# Altium schematic sheet H18R2_Backend.SchDoc
size Letter; CompanyName: Hexabitz; DocumentNumber: 2; SheetNumber: 1; SheetTotal: 2; Module_Name: H18R2; Module_Description: Brushed DC Motor Driver
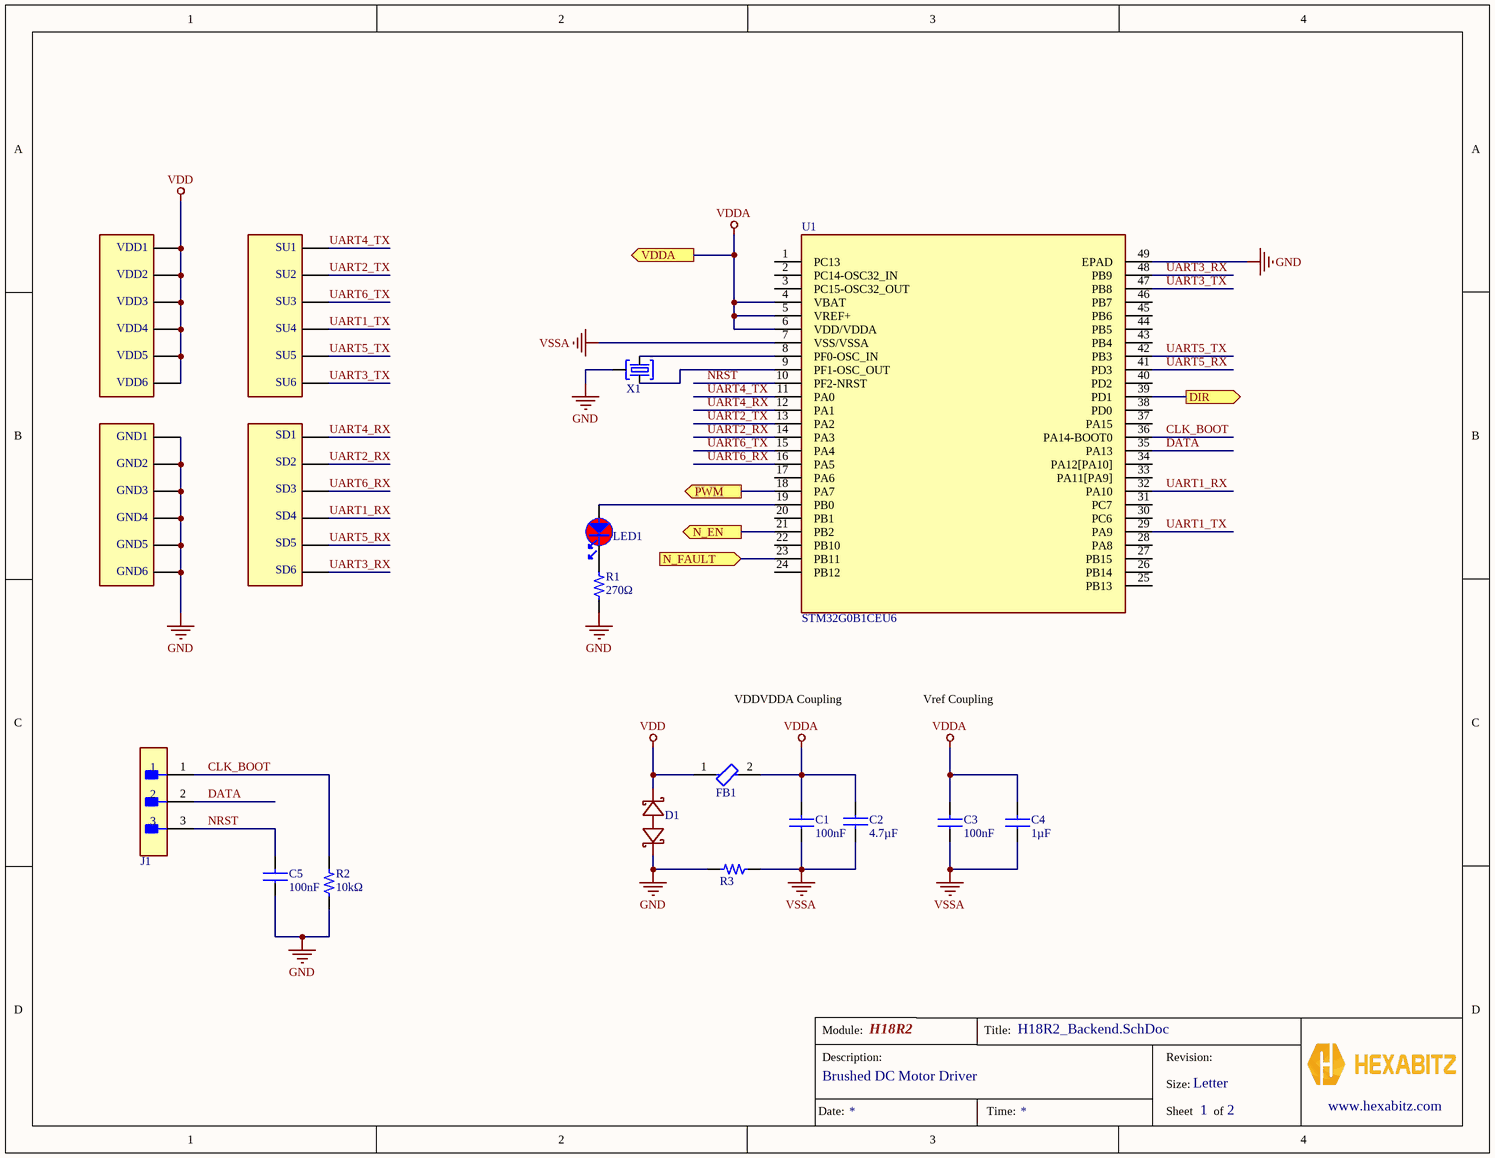
[diagram p0: H18R2_Backend.SchDoc]

## Parts
C1  value 100nF  [C0603]  (hidden comment: CL10B104KA8NNNC)
C2  value 4.7µF  [C0805]  (hidden comment: CL21X475KAQNNNE)
C3  value 100nF  [C0603]  (hidden comment: CL10B104KA8NNNC)
C4  value 1µF  [C0805]  (hidden comment: CC0805KKX7R7BB105)
C5  value 100nF  [C0603]  (hidden comment: CL10B104KA8NNNC)
D1  CDSOD323-T03SC  [SOD2513X114N]  (value not drawn)
FB1  MMZ1608Y300B  [FP-MMZ1608-0_8-MFG]  (value not drawn)
GND1  HEXABIT_UART_PORT  [HEXABIT_POWER_PORT_D]  (value not drawn)  (no BOM)
GND2  HEXABIT_UART_PORT  [HEXABIT_POWER_PORT_D]  (value not drawn)  (no BOM)
GND3  HEXABIT_UART_PORT  [HEXABIT_POWER_PORT_D]  (value not drawn)  (no BOM)
GND4  HEXABIT_UART_PORT  [HEXABIT_POWER_PORT_D]  (value not drawn)  (no BOM)
GND5  HEXABIT_UART_PORT  [HEXABIT_POWER_PORT_D]  (value not drawn)  (no BOM)
GND6  HEXABIT_UART_PORT  [HEXABIT_POWER_PORT_D]  (value not drawn)  (no BOM)
J1  TSW-103-14-G-S  [FP-TSW-103-14-G-S-MFG]  (value not drawn)
LED1  VLMS1300-GS08  [FP-6_541-5092_01-4-MFG]  (value not drawn)
R1  value 270Ω  [R0603]  (hidden comment: Manufacturer Part Number)
R2  value 10kΩ  [R0603]  (hidden comment: Manufacturer Part Number)
R3  Manufacturer Part Number  [R0603]  (value not drawn)
SD1  HEXABIT_UART_PORT  [HEXABIT_UART_PORT_D]  (value not drawn)  (no BOM)
SD2  HEXABIT_UART_PORT  [HEXABIT_UART_PORT_D]  (value not drawn)  (no BOM)
SD3  HEXABIT_UART_PORT  [HEXABIT_UART_PORT_D]  (value not drawn)  (no BOM)
SD4  HEXABIT_UART_PORT  [HEXABIT_UART_PORT_D]  (value not drawn)  (no BOM)
SD5  HEXABIT_UART_PORT  [HEXABIT_UART_PORT_D]  (value not drawn)  (no BOM)
SD6  HEXABIT_UART_PORT  [HEXABIT_UART_PORT_D]  (value not drawn)  (no BOM)
SU1  HEXABIT_UART_PORT  [HEXABIT_UART_PORT_U]  (value not drawn)  (no BOM)
SU2  HEXABIT_UART_PORT  [HEXABIT_UART_PORT_U]  (value not drawn)  (no BOM)
SU3  HEXABIT_UART_PORT  [HEXABIT_UART_PORT_U]  (value not drawn)  (no BOM)
SU4  HEXABIT_UART_PORT  [HEXABIT_UART_PORT_U]  (value not drawn)  (no BOM)
SU5  HEXABIT_UART_PORT  [HEXABIT_UART_PORT_U]  (value not drawn)  (no BOM)
SU6  HEXABIT_UART_PORT  [HEXABIT_UART_PORT_U]  (value not drawn)  (no BOM)
U1  STM32G0B1CEU6  [QFN50P700X700X65-49N-D]
VDD1  HEXABIT_UART_PORT  [HEXABIT_POWER_PORT_U]  (value not drawn)  (no BOM)
VDD2  HEXABIT_UART_PORT  [HEXABIT_POWER_PORT_U]  (value not drawn)  (no BOM)
VDD3  HEXABIT_UART_PORT  [HEXABIT_POWER_PORT_U]  (value not drawn)  (no BOM)
VDD4  HEXABIT_UART_PORT  [HEXABIT_POWER_PORT_U]  (value not drawn)  (no BOM)
VDD5  HEXABIT_UART_PORT  [HEXABIT_POWER_PORT_U]  (value not drawn)  (no BOM)
VDD6  HEXABIT_UART_PORT  [HEXABIT_POWER_PORT_U]  (value not drawn)  (no BOM)
X1  CSTCE8M00G52Z-R0  [XTALL_CSTCE8M00G52]  (value not drawn)

## Ports
DIR (out), N_EN (out), N_FAULT (in), PWM (out), VDDA (out)

## Nets
GND: C5.1 D1.1(A) GND1.Pwr_D GND2.Pwr_D GND3.Pwr_D GND4.Pwr_D GND5.Pwr_D GND6.Pwr_D R1.1 R2.2 R3.1 U1.49(EPAD) X1.P$2
VDD: D1.2(C) FB1.1 VDD1.Pwr_U VDD2.Pwr_U VDD3.Pwr_U VDD4.Pwr_U VDD5.Pwr_U VDD6.Pwr_U
VDDA: C1.2 C2.1 C3.2 C4.2 FB1.2 U1.4(VBAT) U1.5(VREF+) U1.6(VDD/VDDA) ; port VDDA
VSSA: C1.1 C2.2 C3.1 C4.1 R3.2 U1.7(VSS/VSSA)
CLK_BOOT: J1.1 R2.1 U1.36(PA14-BOOT0)
DATA: J1.2 U1.35(PA13)
DIR: U1.39(PD1) ; port DIR
N_EN: U1.21(PB2) ; port N_EN
N_FAULT: U1.23(PB11) ; port N_FAULT
NRST: C5.2 J1.3 U1.10(PF2-NRST)
PWM: U1.18(PA7) ; port PWM
UART1_RX: SD4.UART_D U1.32(PA10)
UART1_TX: SU4.UART_U U1.29(PA9)
UART2_RX: SD2.UART_D U1.14(PA3)
UART2_TX: SU2.UART_U U1.13(PA2)
UART3_RX: SD6.UART_D U1.48(PB9)
UART3_TX: SU6.UART_U U1.47(PB8)
UART4_RX: SD1.UART_D U1.12(PA1)
UART4_TX: SU1.UART_U U1.11(PA0)
UART5_RX: SD5.UART_D U1.41(PD3)
UART5_TX: SU5.UART_U U1.42(PB3)
UART6_RX: SD3.UART_D U1.16(PA5)
UART6_TX: SU3.UART_U U1.15(PA4)
NetLED1_1: LED1.1 R1.2
NetLED1_2: LED1.2 U1.19(PB0)
NetU1_8: U1.8(PF0-OSC_IN) X1.P$3
NetU1_9: U1.9(PF1-OSC_OUT) X1.P$1

Not connected (* = marked no-connect by the designer): U1 1(PC13) 2(PC14-OSC32_IN) 3(PC15-OSC32_OUT) 17(PA6) 20(PB1) 22(PB10) 24(PB12) 25(PB13) 26(PB14) 27(PB15) 28(PA8) 30(PC6) 31(PC7) 33(PA11[PA9]) 34(PA12[PA10]) 37(PA15) 38(PD0) 40(PD2) 43(PB4) 44(PB5) 45(PB6) 46(PB7)

## Notes on the sheet
- VDDVDDA Coupling
- Vref Coupling
- Module:
- Title:
- Description:
- Size:
- Revision:
- Letter
- www.hexabitz.com
- Date:
- Time:
- Sheet
- of

## Library data of the parts
C1 C3 C5 = generic Capacitor: Ceramic Capacitor, Multilayer, Ceramic, 25V, 10% +Tol, 10% -Tol, X7R, +-15% TC, 100nF, Surface Mount, 0603 inch; Manufacturer: Samsung Electro-Mechanics; Library: Hexabitz; Supplier: Avnet; Supplier Part Number: CL10B104KA8NNNC; Manufacturer Part Number: CL10B104KA8NNNC; RoHS: Compliant; Category: Ceramic Capacitors; Stock: 1332000; Pricing: 4000=0.00265, 8000=0.00263, 16000=0.00262, 24000=0.00261, 32000=0.00259 (USD); Case/Package: 0603; Case Code (Imperial): 0603; Case Code (Metric): 1608; China RoHS: Compliant; Depth: 800µm; Dielectric: X7R; Dielectric Material: Ceramic; Height: 800µm; Lead Free: Lead Free; Length: 1.6mm; Lifecycle Status: Production; Material: Ceramic; Max Operating Temperature: 125°C; Min Operating Temperature: -55°C; Mounting Technology: Surface Mount; Number of Terminals: 2; Radiation Hardening: No; REACH SVHC: Yes; Schedule B: 8532240020, 8532240020|8532240020, 8532240020|8532240020|8532240020, 8532240020|8532240020|8532240020|8532240020; Thickness: 889µm; Tolerance: 10%; Voltage: 25V; Voltage Rating: 25V; Voltage Rating (DC): 25V; Width: 800µm; ComponentLink1URL: https://datasheet.octopart.com:443/CL10B104KA8NNNC-Samsung-Electro-Mechanics-datasheet-137745067.pdf?src-supplier=Newark; ComponentLink1Description: https://datasheet.octopart.com:443/CL10B104KA8NNNC-Samsung-Electro-Mechanics-datasheet-137745067.pdf?src-supplier=Newark; ComponentLink2URL: https://datasheet.octopart.com:443/CL10B104KA8NNNC-Samsung-Electro-Mechanics-datasheet-181551448.pdf?src-supplier=Newark; ComponentLink2Description: https://datasheet.octopart.com:443/CL10B104KA8NNNC-Samsung-Electro-Mechanics-datasheet-181551448.pdf?src-supplier=Newark; ComponentLink3URL: https://datasheet.octopart.com/CL10B104KA8NNNC-Samsung-Electro-Mechanics-datasheet-8324245.pdf; ComponentLink3Description: https://datasheet.octopart.com/CL10B104KA8NNNC-Samsung-Electro-Mechanics-datasheet-8324245.pdf; ComponentLink4URL: https://datasheet.octopart.com/CL10B104KA8NNNC-Samsung-Electro-Mechanics-datasheet-97040617.pdf; ComponentLink4Description: https://datasheet.octopart.com/CL10B104KA8NNNC-Samsung-Electro-Mechanics-datasheet-97040617.pdf; ComponentLink5URL: https://datasheet.octopart.com/General-Multilayer-Ceramic-Capacitors-Samsung-datasheet-family-111.pdf; ComponentLink5Description: https://datasheet.octopart.com/General-Multilayer-Ceramic-Capacitors-Samsung-datasheet-family-111.pdf; ComponentLink6URL: https://datasheet.octopart.com:443/CL10B104KA8NNNC-Samsung-Electro-Mechanics-datasheet-116890967.pdf?src-supplier=Future+Electronics; ComponentLink6Description: https://datasheet.octopart.com:443/CL10B104KA8NNNC-Samsung-Electro-Mechanics-datasheet-116890967.pdf?src-supplier=Future+Electronics; ComponentLink7URL: https://datasheet.octopart.com:443/CL10B104KA8NNNC-Samsung-Electro-Mechanics-datasheet-81461838.pdf?src-supplier=Future+Electronics; ComponentLink7Description: https://datasheet.octopart.com:443/CL10B104KA8NNNC-Samsung-Electro-Mechanics-datasheet-81461838.pdf?src-supplier=Future+Electronics; ComponentLink8URL: https://datasheet.octopart.com:443/CL10B104KA8NNNC-Samsung-datasheet-42770371.pdf?src-supplier=Future+Electronics; ComponentLink8Description: https://datasheet.octopart.com:443/CL10B104KA8NNNC-Samsung-datasheet-42770371.pdf?src-supplier=Future+Electronics; ComponentLink9URL: https://datasheet.octopart.com:443/CL10B104KA8NNNC-Samsung-datasheet-26589152.pdf?src-supplier=Future+Electronics; ComponentLink9Description: https://datasheet.octopart.com:443/CL10B104KA8NNNC-Samsung-datasheet-26589152.pdf?src-supplier=Future+Electronics; ComponentLink10URL: https://datasheet.octopart.com:443/CL10B104KA8NNNC-Samsung-Electro-Mechanics-datasheet-149136783.pdf?src-supplier=Future+Electronics; ComponentLink10Description: https://datasheet.octopart.com:443/CL10B104KA8NNNC-Samsung-Electro-Mechanics-datasheet-149136783.pdf?src-supplier=Future+Electronics; ComponentLink11URL: https://datasheet.octopart.com:443/CL10B104KA8NNNC-Samsung-datasheet-59220082.pdf?src-supplier=TME; ComponentLink11Description: https://datasheet.octopart.com:443/CL10B104KA8NNNC-Samsung-datasheet-59220082.pdf?src-supplier=TME; ComponentLink12URL: https://datasheet.octopart.com:443/CL10B104KA8NNNC-Samsung-Electro-Mechanics-datasheet-11756025.pdf?src-supplier=Arrow+Electronics; ComponentLink12Description: https://datasheet.octopart.com:443/CL10B104KA8NNNC-Samsung-Electro-Mechanics-datasheet-11756025.pdf?src-supplier=Arrow+Electronics; ComponentLink13URL: http://sigma.octopart.com:80/rohs_certificate/General-Multilayer-Ceramic-Capacitors-Samsung-family-110.pdf?src-supplier=Compliance+Statements; ComponentLink13Description: http://sigma.octopart.com:80/rohs_certificate/General-Multilayer-Ceramic-Capacitors-Samsung-family-110.pdf?src-supplier=Compliance+Statements; ComponentLink14URL: http://sigma.octopart.com:80/rohs_statement/General-Multilayer-Ceramic-Capacitors-Samsung-family-132.pdf?src-supplier=Compliance+Statements; ComponentLink14Description: http://sigma.octopart.com:80/rohs_statement/General-Multilayer-Ceramic-Capacitors-Samsung-family-132.pdf?src-supplier=Compliance+Statements; ComponentLink15URL: http://sigma.octopart.com:80/reach_statement/General-Multilayer-Ceramic-Capacitors-Samsung-family-133.pdf?src-supplier=Compliance+Statements; ComponentLink15Description: http://sigma.octopart.com:80/reach_statement/General-Multilayer-Ceramic-Capacitors-Samsung-family-133.pdf?src-supplier=Compliance+Statements
  C1: Octopart URL: https://octopart.com/part/samsung-electro-mechanics/CL10B104KA8NNNC
  C5: Supplier 1: Avnet; Supplier Part Number 1: CL10B104KA8NNNC; Octopart URL: https://octopart.com/part/samsung-electro-mechanics/CL10B104KA8NNNC
C2 = generic Capacitor: Ceramic Capacitor, Multilayer, Ceramic, 25V, 10% +Tol, 10% -Tol, X6S, +-22% TC, 4.7uF, Surface Mount, 0805 inch; Manufacturer: Samsung Electro-Mechanics; Library: Hexabitz; Supplier: DigiKey; Supplier Part Number: 1276-3033-1-ND; Manufacturer Part Number: CL21X475KAQNNNE; RoHS: Compliant; Category: Ceramic Capacitors; Stock: 251721; Pricing: 1=0.21, 10=0.124, 50=0.0886, 100=0.0778, 500=0.05972, 1000=0.05414 (USD); Case/Package: 0805; Case Code (Imperial): 0805; Case Code (Metric): 2012; China RoHS: Compliant; Depth: 1.25mm; Dielectric: X6S; Dielectric Material: Ceramic; Height: 1.4mm; Lead Free: Lead Free; Length: 2mm; Lifecycle Status: Production; Material: Ceramic; Max Operating Temperature: 105°C; Min Operating Temperature: -55°C; Mounting Technology: Surface Mount; Number of Terminals: 2; Packaging: Tape & Reel (TR); REACH SVHC: Yes; Schedule B: 8532240020, 8532240020|8532240020, 8532240020|8532240020|8532240020, 8532240020|8532240020|8532240020|8532240020; Thickness: 1.397mm; Tolerance: 10%; Voltage Rating: 25V; Voltage Rating (DC): 25V; Width: 1.25mm; ComponentLink1URL: https://datasheet.octopart.com:443/CL21X475KAQNNNE-Samsung-Electro-Mechanics-datasheet-141347921.pdf?src-supplier=IHS; ComponentLink1Description: https://datasheet.octopart.com:443/CL21X475KAQNNNE-Samsung-Electro-Mechanics-datasheet-141347921.pdf?src-supplier=IHS; ComponentLink2URL: https://datasheet.octopart.com/CL21X475KAQNNNE-Samsung-Electro-Mechanics-datasheet-97040617.pdf; ComponentLink2Description: https://datasheet.octopart.com/CL21X475KAQNNNE-Samsung-Electro-Mechanics-datasheet-97040617.pdf; ComponentLink3URL: https://datasheet.octopart.com/CL21X475KAQNNNE-Samsung-Electro-Mechanics-datasheet-8324245.pdf; ComponentLink3Description: https://datasheet.octopart.com/CL21X475KAQNNNE-Samsung-Electro-Mechanics-datasheet-8324245.pdf; ComponentLink4URL: https://datasheet.octopart.com:443/CL21X475KAQNNNE-Samsung-datasheet-8326817.pdf?src-supplier=Future+Electronics; ComponentLink4Description: https://datasheet.octopart.com:443/CL21X475KAQNNNE-Samsung-datasheet-8326817.pdf?src-supplier=Future+Electronics; ComponentLink5URL: https://datasheet.octopart.com:443/CL21X475KAQNNNE-Samsung-datasheet-8326407.pdf?src-supplier=TME; ComponentLink5Description: https://datasheet.octopart.com:443/CL21X475KAQNNNE-Samsung-datasheet-8326407.pdf?src-supplier=TME; ComponentLink6URL: https://datasheet.octopart.com:443/CL21X475KAQNNNE-Samsung-Electro-Mechanics-datasheet-11541288.pdf?src-supplier=Arrow+Electronics; ComponentLink6Description: https://datasheet.octopart.com:443/CL21X475KAQNNNE-Samsung-Electro-Mechanics-datasheet-11541288.pdf?src-supplier=Arrow+Electronics; Octopart URL: https://octopart.com/part/samsung-electro-mechanics/CL21A475KAQNNNE
C4 = generic Capacitor: Ceramic Capacitor, Ceramic, 16V, 10% +Tol, 10% -Tol, X7R, 15% TC, 1uF, Surface Mount, 0805; Manufacturer: Yageo Group; Manufacturer Package Identifier: CC0805-0.85; Library: Hexabitz; Supplier: Future Electronics; Supplier Part Number: 9937277; Manufacturer Part Number: CC0805KKX7R7BB105; RoHS: Compliant; Category: Ceramic Capacitors; Stock: 384000; Pricing: 3000=0.0057, 12000=0.0055, 45000=0.0053, 90000=0.0052, 225000=0.005 (USD); Case/Package: 0805; Case Code (Imperial): 0805; Case Code (Metric): 2012; China RoHS: Compliant; Depth: 1.25mm; Dielectric: X7R; Dielectric Material: Ceramic; Halogen Free: Halogen Free; Height: 1.25mm; Lead Free: Lead Free; Length: 2mm; Lifecycle Status: Production; Material: Ceramic; Max Operating Temperature: 125°C; Min Operating Temperature: -55°C; Mounting Technology: Surface Mount; Pins: 2; Number of Terminals: 2; Radiation Hardening: No; REACH SVHC: Yes; Schedule B: 8532240020, 8532240020|8532240020|8532240020|8532240020|8532240020|8532240020|8532240020|8532240020|8532240020|8532240020|8532240020|8532240020, 8532240020|8532240020|8532240020|8532240020|8532240020|8532240020|8532240020|8532240020|8532240020|8532240020|8532240020|8532240020|8532240020, 8532240020|8532240020|8532240020|8532240020|8532240020|8532240020|8532240020|8532240020|8532240020|8532240020|8532240020|8532240020|8532240020|8532240020; Termination: SMD/SMT; Thickness: 1.2446mm; Tolerance: 10%; Voltage Rating: 16V; Voltage Rating (DC): 16V; Width: 1.25mm; ComponentLink1URL: https://datasheet.octopart.com:443/CC0805KKX7R7BB105-Yageo-datasheet-177165144.pdf?src-supplier=IHS; ComponentLink1Description: https://datasheet.octopart.com:443/CC0805KKX7R7BB105-Yageo-datasheet-177165144.pdf?src-supplier=IHS; ComponentLink2URL: https://datasheet.octopart.com:443/CC0805KKX7R7BB105-Yageo-datasheet-78855689.pdf?src-supplier=Upverter; ComponentLink2Description: https://datasheet.octopart.com:443/CC0805KKX7R7BB105-Yageo-datasheet-78855689.pdf?src-supplier=Upverter; ComponentLink3URL: https://datasheet.octopart.com/CC0805KKX7R7BB105-Yageo-datasheet-10883670.pdf; ComponentLink3Description: https://datasheet.octopart.com/CC0805KKX7R7BB105-Yageo-datasheet-10883670.pdf; ComponentLink4URL: https://datasheet.octopart.com:443/CC0805KKX7R7BB105-Yageo-datasheet-140260305.pdf?src-supplier=SOS+electronic; ComponentLink4Description: https://datasheet.octopart.com:443/CC0805KKX7R7BB105-Yageo-datasheet-140260305.pdf?src-supplier=SOS+electronic; ComponentLink5URL: https://datasheet.octopart.com:443/CC0805KKX7R7BB105-Yageo-datasheet-147453679.pdf?src-supplier=Farnell; ComponentLink5Description: https://datasheet.octopart.com:443/CC0805KKX7R7BB105-Yageo-datasheet-147453679.pdf?src-supplier=Farnell; ComponentLink6URL: https://datasheet.octopart.com:443/CC0805KKX7R7BB105-Yageo-datasheet-181969634.pdf?src-supplier=Farnell; ComponentLink6Description: https://datasheet.octopart.com:443/CC0805KKX7R7BB105-Yageo-datasheet-181969634.pdf?src-supplier=Farnell; ComponentLink7URL: https://datasheet.octopart.com:443/CC0805KKX7R7BB105-Yageo-datasheet-62336348.pdf?src-supplier=element14+APAC; ComponentLink7Description: https://datasheet.octopart.com:443/CC0805KKX7R7BB105-Yageo-datasheet-62336348.pdf?src-supplier=element14+APAC; ComponentLink8URL: https://datasheet.octopart.com:443/CC0805KKX7R7BB105-Yageo-datasheet-166511530.pdf?src-supplier=Future+Electronics; ComponentLink8Description: https://datasheet.octopart.com:443/CC0805KKX7R7BB105-Yageo-datasheet-166511530.pdf?src-supplier=Future+Electronics; ComponentLink9URL: https://datasheet.octopart.com:443/CC0805KKX7R7BB105-Yageo-datasheet-137700082.pdf?src-supplier=Future+Electronics; ComponentLink9Description: https://datasheet.octopart.com:443/CC0805KKX7R7BB105-Yageo-datasheet-137700082.pdf?src-supplier=Future+Electronics; ComponentLink10URL: https://datasheet.octopart.com:443/CC0805KKX7R7BB105-Yageo-datasheet-137700084.pdf?src-supplier=Future+Electronics; ComponentLink10Description: https://datasheet.octopart.com:443/CC0805KKX7R7BB105-Yageo-datasheet-137700084.pdf?src-supplier=Future+Electronics; ComponentLink11URL: https://datasheet.octopart.com:443/CC0805KKX7R7BB105-Yageo-datasheet-27626582.pdf?src-supplier=Future+Electronics; ComponentLink11Description: https://datasheet.octopart.com:443/CC0805KKX7R7BB105-Yageo-datasheet-27626582.pdf?src-supplier=Future+Electronics; ComponentLink12URL: https://datasheet.octopart.com:443/CC0805KKX7R7BB105-Yageo-datasheet-15895757.pdf?src-supplier=Future+Electronics; ComponentLink12Description: https://datasheet.octopart.com:443/CC0805KKX7R7BB105-Yageo-datasheet-15895757.pdf?src-supplier=Future+Electronics; ComponentLink13URL: https://datasheet.octopart.com:443/CC0805KKX7R7BB105-Yageo-datasheet-12526321.pdf?src-supplier=Future+Electronics; ComponentLink13Description: https://datasheet.octopart.com:443/CC0805KKX7R7BB105-Yageo-datasheet-12526321.pdf?src-supplier=Future+Electronics; ComponentLink14URL: https://datasheet.octopart.com:443/CC0805KKX7R7BB105-Yageo-datasheet-10911834.pdf?src-supplier=Future+Electronics; ComponentLink14Description: https://datasheet.octopart.com:443/CC0805KKX7R7BB105-Yageo-datasheet-10911834.pdf?src-supplier=Future+Electronics; ComponentLink15URL: https://datasheet.octopart.com:443/CC0805KKX7R7BB105-Yageo-datasheet-8324442.pdf?src-supplier=Future+Electronics; ComponentLink15Description: https://datasheet.octopart.com:443/CC0805KKX7R7BB105-Yageo-datasheet-8324442.pdf?src-supplier=Future+Electronics; ComponentLink16URL: https://datasheet.octopart.com:443/CC0805KKX7R7BB105-Yageo-Group-datasheet-165992755.pdf?src-supplier=ODG+(Origin+Data+Global); ComponentLink16Description: https://datasheet.octopart.com:443/CC0805KKX7R7BB105-Yageo-Group-datasheet-165992755.pdf?src-supplier=ODG+(Origin+Data+Global); ComponentLink17URL: https://datasheet.octopart.com:443/CC0805KKX7R7BB105-Yageo-datasheet-151948686.pdf?src-supplier=TME; ComponentLink17Description: https://datasheet.octopart.com:443/CC0805KKX7R7BB105-Yageo-datasheet-151948686.pdf?src-supplier=TME; ComponentLink18URL: https://datasheet.octopart.com:443/CC0805KKX7R7BB105-Yageo-datasheet-8324192.pdf?src-supplier=TME; ComponentLink18Description: https://datasheet.octopart.com:443/CC0805KKX7R7BB105-Yageo-datasheet-8324192.pdf?src-supplier=TME; ComponentLink19URL: https://datasheet.octopart.com:443/CC0805KKX7R7BB105-Yageo-datasheet-120101875.pdf?src-supplier=Megastar; ComponentLink19Description: https://datasheet.octopart.com:443/CC0805KKX7R7BB105-Yageo-datasheet-120101875.pdf?src-supplier=Megastar; ComponentLink20URL: https://datasheet.octopart.com:443/CC0805KKX7R7BB105-Yageo-datasheet-8701427.pdf?src-supplier=element14; ComponentLink20Description: https://datasheet.octopart.com:443/CC0805KKX7R7BB105-Yageo-datasheet-8701427.pdf?src-supplier=element14; ComponentLink21URL: https://datasheet.octopart.com:443/CC0805KKX7R7BB105-Yageo-datasheet-499490.pdf?src-supplier=element14; ComponentLink21Description: https://datasheet.octopart.com:443/CC0805KKX7R7BB105-Yageo-datasheet-499490.pdf?src-supplier=element14; ComponentLink22URL: https://datasheet.octopart.com:443/CC0805KKX7R7BB105-Yageo-datasheet-5301394.pdf?src-supplier=element14; ComponentLink22Description: https://datasheet.octopart.com:443/CC0805KKX7R7BB105-Yageo-datasheet-5301394.pdf?src-supplier=element14; ComponentLink23URL: http://sigma.octopart.com:80/rohs_statement/Yageo-company-2.pdf?src-supplier=Compliance+Statements; ComponentLink23Description: http://sigma.octopart.com:80/rohs_statement/Yageo-company-2.pdf?src-supplier=Compliance+Statements; ComponentLink24URL: http://sigma.octopart.com:80/conflict_mineral_statement/Yageo-company-3.pdf?src-supplier=Compliance+Statements; ComponentLink24Description: http://sigma.octopart.com:80/conflict_mineral_statement/Yageo-company-3.pdf?src-supplier=Compliance+Statements; Supplier 1: Avnet; Supplier Part Number 1: 68R4880; Octopart URL: https://octopart.com/part/yageo-group/CC0805KKX7R7BB105
D1 = CDSOD323-T03SC: A 3V, 350W, bi-directional, standard capacitance, SOD323 pkg TVS Diode | Bourns CDSOD323-T03SC; Library: Hexabitz; Breakdown Voltage: 4V; Value: 200pF; Clamping Voltage: 10.9V; Direction: Bidirectional; Element Configuration: Single; Leakage Current: 125µA; Max Power Dissipation: 400W; Max Surge Current: 43A; Number of Bidirectional Channels: 1; Operating Supply Voltage: 3.3V; Power Line Protection: No; Supplier: DigiKey; Supplier Part Number: CDSOD323-T03SCDKR-ND; Manufacturer: Bourns; Manufacturer Part Number: CDSOD323-T03SC; RoHS: Compliant; Category: TVS Diodes; Stock: 937; Pricing: 1=0.69, 10=0.604, 100=0.418, 500=0.343, 1000=0.297 (USD); China RoHS: Compliant; Composition: Zener; Contact Plating: Tin; Depth: 1.45mm; Length: 1.9mm; Lifecycle Status: Production; Max Operating Temperature: 150°C; Min Breakdown Voltage: 4V; Min Operating Temperature: -55°C; Mounting Technology: Surface Mount; Number of Channels: 1; Number of Elements: 1; Pins: 2; Number of Terminals: 2; Peak Pulse Current: 43A; Peak Pulse Power: 400W; Peak Reverse Current: 125µA; Polarity: Bidirectional; Radiation Hardening: No; REACH SVHC: Yes; Reverse Standoff Voltage: 3.3V; Termination: SMD/SMT; Working Voltage: 3.3V; ComponentLink1URL: https://datasheet.octopart.com:443/CDSOD323-T03SC-Bourns-datasheet-179966067.pdf?src-supplier=IHS; ComponentLink1Description: https://datasheet.octopart.com:443/CDSOD323-T03SC-Bourns-datasheet-179966067.pdf?src-supplier=IHS; ComponentLink2URL: https://datasheet.octopart.com:443/CDSOD323-T03SC-Bourns-datasheet-134530207.pdf?src-supplier=Electro+Sonic; ComponentLink2Description: https://datasheet.octopart.com:443/CDSOD323-T03SC-Bourns-datasheet-134530207.pdf?src-supplier=Electro+Sonic; ComponentLink3URL: https://datasheet.octopart.com:443/CDSOD323-T03SC-Bourns-datasheet-11734656.pdf?src-supplier=Burklin+Elektronik; ComponentLink3Description: https://datasheet.octopart.com:443/CDSOD323-T03SC-Bourns-datasheet-11734656.pdf?src-supplier=Burklin+Elektronik; ComponentLink4URL: https://datasheet.octopart.com:443/CDSOD323-T03SC-Bourns-datasheet-37162147.pdf?src-supplier=Farnell; ComponentLink4Description: https://datasheet.octopart.com:443/CDSOD323-T03SC-Bourns-datasheet-37162147.pdf?src-supplier=Farnell; ComponentLink5URL: https://datasheet.octopart.com:443/CDSOD323-T03SC-Bourns-datasheet-159777421.pdf?src-supplier=RS+(Formerly+Allied+Electronics); ComponentLink5Description: https://datasheet.octopart.com:443/CDSOD323-T03SC-Bourns-datasheet-159777421.pdf?src-supplier=RS+(Formerly+Allied+Electronics); ComponentLink6URL: http://sigma.octopart.com:80/conflict_mineral_statement/Bourns-company-36.pdf?src-supplier=Compliance+Statements; ComponentLink6Description: http://sigma.octopart.com:80/conflict_mineral_statement/Bourns-company-36.pdf?src-supplier=Compliance+Statements; Supplier 1: DigiKey; Supplier Part Number 1: CDSOD323-T03SCDKR-ND; Octopart URL: https://octopart.com/part/bourns/CDSOD323-T03SC
FB1 = MMZ1608Y300B: Ferrite Beads 0603 30ohms 1500mA Signal Line AEC-Q200; Manufacturer: TDK; Manufacturer Part Number: MMZ1608Y300BTD25; Manufacturer Lifecycle Status: PRODUCTION; Library: Hexabitz; Current Rating: 1.5A; DC Resistance (DCR): 50mΩ; Impedance: 30Ω; Number of Circuits: 1; Test Frequency: 100MHz; Tolerance: 25%; Supplier: DigiKey; Supplier Part Number: 445-MMZ1608Y300BTD25DKR-ND; RoHS: Compliant; Category: Ferrite Beads and Chips; Stock: 11896; Pricing: 1=0.1, 10=0.06, 25=0.052, 50=0.0468, 100=0.0419, 250=0.03612, 500=0.03214, 1000=0.02847 (USD); Case/Package: 0603; Case Code (Imperial): 0603; Case Code (Metric): 1608; Core Material: Ferrite; Height: 800µm; Length: 1.6mm; Lifecycle Status: Production; Max Current Rating: 1.5A; Max DC Current: 1.5A; Max Length: 1.75mm; Max Operating Temperature: 125°C; Max Width: 950µm; Min Length: 1.45mm; Min Operating Temperature: -55°C; Min Width: 650µm; Mounting Technology: Surface Mount; Number of Lines: 1; Number of Terminals: 2; Packaging: Tape & Reel (TR); Ratings: AEC-Q200; REACH SVHC: Yes; RMS Current (Irms): 1.5A; ESR: 50mΩ; Termination: SMD/SMT; Weight: 2.012816mg; Width: 800µm; ComponentLink1URL: https://datasheet.octopart.com:443/MMZ1608Y300BTD25-TDK-datasheet-181268448.pdf?src-supplier=IHS; ComponentLink1Description: https://datasheet.octopart.com:443/MMZ1608Y300BTD25-TDK-datasheet-181268448.pdf?src-supplier=IHS; ComponentLink2URL: https://datasheet.octopart.com:443/MMZ1608Y300BTD25-TDK-datasheet-151367874.pdf?src-supplier=TDK; ComponentLink2Description: https://datasheet.octopart.com:443/MMZ1608Y300BTD25-TDK-datasheet-151367874.pdf?src-supplier=TDK; Supplier 1: Digikey; Supplier Part Number 1: 445-MMZ1608Y300BTA00DKR-ND; Octopart URL: https://octopart.com/part/tdk/MMZ1608Y300BTA00
GND1-GND6 = HEXABIT_POWER_PORT_D
J1 = CMP-02766-001743-1: CONN HEADER VERT 3POS 2.54MM; Manufacturer: Samtec; Max Voltage Rating (AC): 550V; Number of Positions: 3; Max Current Rating: 7.6A; Gender: Male; Termination: Solder; RoHS Compliant: Yes; Mount: Through Hole; Lead Free: Lead Free; Connector Type: Header; REACH SVHC: No SVHC; Insulation Color: Black; Width: 2.54mm; Length: 7.62mm; Flammability Rating: UL94 V-0; Housing Material: Polyester; Contact Material: Bronze; Max Operating Temperature: 125°C; Fastening Type: Pull; Series: TSW; Number of Contacts: 3; Packaging: Bulk; Min Operating Temperature: -55°C; Package Quantity: 1; Height: 10.67mm; Pitch: 2.54mm; Contact Finish - Mating: GOLD; Contact Type: Male Pin; Radiation Hardening: No; Color: Black; Housing Color: Black; Contact Plating: Gold; Orientation: Straight; Number of Rows: 1; Depth: 2.54mm; Insulation Material: PBT; Contact Mating Length: 0.32inch; Contact Shape: Square; Manufacturer Part Number: TSW-103-14-G-S; Octopart URL: https://octopart.com/part/samtec/TSW-103-14-G-S
LED1 = VLMS1300-GS08: LED Uni-Color Super Red 639nm 2-Pin Chip 0603(1608Metric) T/R; Manufacturer: Vishay Semiconductors; Library: Hexabitz; Viewing Angle: 130°; Lens Style: Rectangular,Clear; Number of LEDs: 1; Luminous Intensity: 54mcd; Forward Voltage: 2V; Wavelength: 631nm; Forward Current: 20mA; Power Rating: 75mW; Supplier: Digikey; Supplier Part Number: VLMS1300-GS08DKR-ND; Manufacturer Part Number: VLMS1300-GS08; RoHS: Yes; Category: LEDs; Stock: 56745; Pricing: 1=0.21, 10=0.143, 100=0.0998, 500=0.07982, 1000=0.07322 (USD); Mounting Technology: Surface Mount; Case/Package: 0603; Color: Red; Case Code (Metric): 1608; Case Code (Imperial): 0603; Min Operating Temperature: -35°C; Max Operating Temperature: 85°C; Package Quantity: 1; Packaging: Tape and Reel; Illumination Color: Red; Dominant Wavelength: 631nm; Test Current: 20mA; Series: CHipLED; Length: 1.6mm; Width: 0.8mm; Height: 0.8mm; Radiation Hardening: No; Lead Free: Lead Free; RoHS Compliant: Yes; Reach SVHC Compliant: Unknown; ComponentLink1URL: https://datasheet.ciiva.com/26322/vlmo1300-26322153.pdf?src-supplier=Element14; ComponentLink1Description: https://datasheet.ciiva.com/26322/vlmo1300-26322153.pdf?src-supplier=Element14; ComponentLink2URL: https://datasheet.ciiva.com/8028/vlmo1300-8028047.pdf?src-supplier=Element14; ComponentLink2Description: https://datasheet.ciiva.com/8028/vlmo1300-8028047.pdf?src-supplier=Element14; ComponentLink3URL: https://datasheet.ciiva.com/9333/vlmo1300-9333743.pdf?src-supplier=Avnet; ComponentLink3Description: https://datasheet.ciiva.com/9333/vlmo1300-9333743.pdf?src-supplier=Avnet; ComponentLink4URL: https://datasheet.ciiva.com/16510/vlmo1300-16510985.pdf?src-supplier=Future+Electronics; ComponentLink4Description: https://datasheet.ciiva.com/16510/vlmo1300-16510985.pdf?src-supplier=Future+Electronics; ComponentLink5URL: https://datasheet.ciiva.com/2114/vlmo1300-2114930.pdf?src-supplier=Digikey; ComponentLink5Description: https://datasheet.ciiva.com/2114/vlmo1300-2114930.pdf?src-supplier=Digikey; ComponentLink6URL: https://datasheet.ciiva.com/2114/vlmo1300-2114931.pdf?src-supplier=Digikey; ComponentLink6Description: https://datasheet.ciiva.com/2114/vlmo1300-2114931.pdf?src-supplier=Digikey; ComponentLink7URL: https://datasheet.ciiva.com/2114/vlmo1300-2114929.pdf?src-supplier=Digikey; ComponentLink7Description: https://datasheet.ciiva.com/2114/vlmo1300-2114929.pdf?src-supplier=Digikey; Supplier 1: Digikey; Supplier Part Number 1: VLMS1300-GS08DKR-ND; Octopart URL: https://octopart.com/part/vishay/VLMS1300-GS08
R1 = generic Resistor: Res Thick Film 0603 270 Ohm 5% 0.1W(1/10W) ±200ppm/C Pad SMD Automotive T/R; Manufacturer: Panasonic; Manufacturer Part Number: ERJ-3GEYJ271V; Library: Hexabitz; Max Power Dissipation: 100mW; Temperature Coefficient: 200ppm/°C; Voltage Rating: 75V; Supplier: Avnet; Supplier Part Number: ERJ-3GEYJ271V; RoHS: Compliant; Category: Chip SMD Resistors; Stock: 45000; Pricing: 5000=0.00355, 10000=0.00348, 20000=0.00342, 30000=0.00335, 40000=0.00329 (USD); Case/Package: 0603; Case Code (Imperial): 0603; Composition: Thick Film; Contact Plating: Tin; Depth: 800µm; Features: Automotive AEC-Q200; Height: 450µm; Lead Free: Lead Free; Length: 1.6mm; Lifecycle Status: Production; Max Operating Temperature: 155°C; Military Standard: Not; Min Operating Temperature: -55°C; Mounting Technology: Surface Mount; Number of Terminals: 2; Number of Terminations: 2; Packaging: Cut Tape; Power Dissipation: 100mW; Power Rating: 100mW; Radiation Hardening: No; REACH SVHC: Yes; Schedule B: 8533210045, 8533210045|8533210045|8533210045|8533210045|8533210045|8533210045|8533210045|8533210045|8533210045|8533210045|8533210045|8533210045|8533210045|8533210045|8533210045|8533210045|8533210045|8533210045|8533210045|8533210045|8533210045|8533210045|8533210045|85; Termination: SMD/SMT; Tolerance: 5%; Voltage Rating (DC): 75V; Width: 800µm; Working Voltage: 75V; ComponentLink1URL: https://datasheet.octopart.com:443/ERJ-3GEYJ271V-Panasonic-datasheet-13266872.pdf?src-supplier=RS+(Formerly+Allied+Electronics); ComponentLink1Description: https://datasheet.octopart.com:443/ERJ-3GEYJ271V-Panasonic-datasheet-13266872.pdf?src-supplier=RS+(Formerly+Allied+Electronics); ComponentLink2URL: https://datasheet.octopart.com:443/ERJ-3GEYJ271V-Panasonic-datasheet-5314550.pdf?src-supplier=Future+Electronics; ComponentLink2Description: https://datasheet.octopart.com:443/ERJ-3GEYJ271V-Panasonic-datasheet-5314550.pdf?src-supplier=Future+Electronics; ComponentLink3URL: https://datasheet.octopart.com:443/ERJ-3GEYJ271V-Panasonic-datasheet-61114972.pdf?src-supplier=Panasonic+SCT; ComponentLink3Description: https://datasheet.octopart.com:443/ERJ-3GEYJ271V-Panasonic-datasheet-61114972.pdf?src-supplier=Panasonic+SCT; ComponentLink4URL: https://datasheet.octopart.com:443/ERJ-3GEYJ271V-Panasonic-datasheet-147443676.pdf?src-supplier=Master+Electronics; ComponentLink4Description: https://datasheet.octopart.com:443/ERJ-3GEYJ271V-Panasonic-datasheet-147443676.pdf?src-supplier=Master+Electronics; ComponentLink5URL: https://datasheet.octopart.com:443/ERJ-3GEYJ271V-Panasonic-datasheet-10554283.pdf?src-supplier=element14+APAC; ComponentLink5Description: https://datasheet.octopart.com:443/ERJ-3GEYJ271V-Panasonic-datasheet-10554283.pdf?src-supplier=element14+APAC; ComponentLink6URL: https://datasheet.octopart.com:443/ERJ3GEYJ271V-Panasonic-datasheet-165581512.pdf?src-supplier=TME; ComponentLink6Description: https://datasheet.octopart.com:443/ERJ3GEYJ271V-Panasonic-datasheet-165581512.pdf?src-supplier=TME; ComponentLink7URL: https://datasheet.octopart.com:443/ERJ-3GEYJ271V-Panasonic-datasheet-164353788.pdf?src-supplier=Newark; ComponentLink7Description: https://datasheet.octopart.com:443/ERJ-3GEYJ271V-Panasonic-datasheet-164353788.pdf?src-supplier=Newark; ComponentLink8URL: https://datasheet.octopart.com:443/ERJ3GEYJ271V-Panasonic-datasheet-136608608.pdf?src-supplier=Farnell; ComponentLink8Description: https://datasheet.octopart.com:443/ERJ3GEYJ271V-Panasonic-datasheet-136608608.pdf?src-supplier=Farnell; ComponentLink9URL: https://datasheet.octopart.com:443/ERJ-3GEYJ271V-Panasonic---ECG-datasheet-15994758.pdf?src-supplier=Farnell; ComponentLink9Description: https://datasheet.octopart.com:443/ERJ-3GEYJ271V-Panasonic---ECG-datasheet-15994758.pdf?src-supplier=Farnell; ComponentLink10URL: https://datasheet.octopart.com:443/ERJ-3GEYJ271V-Panasonic-datasheet-5313456.pdf?src-supplier=Farnell; ComponentLink10Description: https://datasheet.octopart.com:443/ERJ-3GEYJ271V-Panasonic-datasheet-5313456.pdf?src-supplier=Farnell; ComponentLink11URL: https://datasheet.octopart.com/ERJ-3GEYJ271V-Panasonic-datasheet-78375410.pdf; ComponentLink11Description: https://datasheet.octopart.com/ERJ-3GEYJ271V-Panasonic-datasheet-78375410.pdf; ComponentLink12URL: https://datasheet.octopart.com/Thick-Film-Chip-Resistors-Panasonic-datasheet-family-105.pdf; ComponentLink12Description: https://datasheet.octopart.com/Thick-Film-Chip-Resistors-Panasonic-datasheet-family-105.pdf; ComponentLink13URL: https://datasheet.octopart.com:443/ERJ-3GEYJ271V-Panasonic-datasheet-7538305.pdf?src-supplier=Jameco; ComponentLink13Description: https://datasheet.octopart.com:443/ERJ-3GEYJ271V-Panasonic-datasheet-7538305.pdf?src-supplier=Jameco; ComponentLink14URL: https://datasheet.octopart.com:443/ERJ-3GEYJ271V-Panasonic-datasheet-118655.pdf?src-supplier=DigiKey; ComponentLink14Description: https://datasheet.octopart.com:443/ERJ-3GEYJ271V-Panasonic-datasheet-118655.pdf?src-supplier=DigiKey; ComponentLink15URL: https://datasheet.octopart.com:443/ERJ3GEYJ271V-Panasonic-datasheet-27908757.pdf?src-supplier=Electro+Sonic; ComponentLink15Description: https://datasheet.octopart.com:443/ERJ3GEYJ271V-Panasonic-datasheet-27908757.pdf?src-supplier=Electro+Sonic; ComponentLink16URL: https://datasheet.octopart.com:443/ERJ-3GEYJ271V-Panasonic-datasheet-37173568.pdf?src-supplier=Electro+Sonic; ComponentLink16Description: https://datasheet.octopart.com:443/ERJ-3GEYJ271V-Panasonic-datasheet-37173568.pdf?src-supplier=Electro+Sonic; Octopart URL: https://octopart.com/part/panasonic/ERJ-3GEYJ271V
R2 = generic Resistor: 100mW Thick Film Resistors ±100ppm/℃ ±1% 10kΩ 0603 Chip Resistor - Surface Mount ROHS; Manufacturer: Yageo Group; Manufacturer Part Number: RC0603FR-0710KL; Library: Hexabitz; Temperature Coefficient: 100ppm/°C; Voltage Rating: 75V; Voltage Rating (DC): 50V; Supplier: Future Electronics; Supplier Part Number: 4023214; RoHS: Compliant; Category: Chip SMD Resistors; Stock: 22990000; Pricing: 5000=0.001, 25000=0.001, 150000=0.001, 500000=0.0009, 1500000=0.0009 (USD); Case/Package: 0603; Case Code (Imperial): 0603; Case Code (Metric): 0603; China RoHS: Non-Compliant; Composition: Thick Film; Depth: 800µm; Height: 450µm; Lead Free: Lead Free; Lead Pitch: 300µm; Length: 1.6mm; Lifecycle Status: Production; Max Operating Temperature: 155°C; Military Standard: Not; Min Operating Temperature: -55°C; Mounting Technology: Surface Mount; Pins: 2; Number of Terminals: 2; Packaging: Tape & Reel; Power Dissipation: 100mW; Power Rating: 100mW; REACH SVHC: Yes; Schedule B: 8533210045, 8533210045|8533210045|8533210045|8533210045|8533210045|8533210045|8533210045|8533210045|8533210045|8533210045|8533210045|8533210045|8533210045|8533210045|8533210045|8533210045|8533210045|8533210045|8533210045|8533210045|8533210045|8533210045|8533210045|85; Termination: SMD/SMT; Tolerance: 1%; Weight: 2.012816mg; Width: 800µm; Working Voltage: 75V; ComponentLink1URL: https://datasheet.octopart.com:443/RC0603FR-0710KL-Yageo-datasheet-175887523.pdf?src-supplier=IHS; ComponentLink1Description: https://datasheet.octopart.com:443/RC0603FR-0710KL-Yageo-datasheet-175887523.pdf?src-supplier=IHS; ComponentLink2URL: https://datasheet.octopart.com:443/RC0603FR-0710KL-Yageo-datasheet-103092701.pdf?src-supplier=Upverter; ComponentLink2Description: https://datasheet.octopart.com:443/RC0603FR-0710KL-Yageo-datasheet-103092701.pdf?src-supplier=Upverter; ComponentLink3URL: https://datasheet.octopart.com:443/RC0603FR-0710KL-Yageo-datasheet-98239111.pdf?src-supplier=Upverter; ComponentLink3Description: https://datasheet.octopart.com:443/RC0603FR-0710KL-Yageo-datasheet-98239111.pdf?src-supplier=Upverter; ComponentLink4URL: https://datasheet.octopart.com:443/RC0603FR-0710KL-Yageo-datasheet-141265859.pdf?src-supplier=Upverter; ComponentLink4Description: https://datasheet.octopart.com:443/RC0603FR-0710KL-Yageo-datasheet-141265859.pdf?src-supplier=Upverter; ComponentLink5URL: https://sigma.octopart.com:443/138820526/technical_drawing/Yageo-RC0603FR-0710KL.pdf?src-supplier=Upverter; ComponentLink5Description: https://sigma.octopart.com:443/138820526/technical_drawing/Yageo-RC0603FR-0710KL.pdf?src-supplier=Upverter; ComponentLink6URL: https://datasheet.octopart.com:443/RC0603FR-0710KL-Yageo-datasheet-8328172.pdf?src-supplier=Farnell; ComponentLink6Description: https://datasheet.octopart.com:443/RC0603FR-0710KL-Yageo-datasheet-8328172.pdf?src-supplier=Farnell; ComponentLink7URL: https://datasheet.octopart.com:443/RC0603FR-0710KL-Yageo-datasheet-13691069.pdf?src-supplier=Farnell; ComponentLink7Description: https://datasheet.octopart.com:443/RC0603FR-0710KL-Yageo-datasheet-13691069.pdf?src-supplier=Farnell; ComponentLink8URL: https://datasheet.octopart.com:443/RC0603FR-0710KL-Yageo-datasheet-62067350.pdf?src-supplier=element14+APAC; ComponentLink8Description: https://datasheet.octopart.com:443/RC0603FR-0710KL-Yageo-datasheet-62067350.pdf?src-supplier=element14+APAC; ComponentLink9URL: https://datasheet.octopart.com:443/RC0603FR-0710KL-Yageo-datasheet-17842380.pdf?src-supplier=element14+APAC; ComponentLink9Description: https://datasheet.octopart.com:443/RC0603FR-0710KL-Yageo-datasheet-17842380.pdf?src-supplier=element14+APAC; ComponentLink10URL: https://datasheet.octopart.com:443/RC0603FR-0710KL-Yageo-datasheet-15599030.pdf?src-supplier=Future+Electronics; ComponentLink10Description: https://datasheet.octopart.com:443/RC0603FR-0710KL-Yageo-datasheet-15599030.pdf?src-supplier=Future+Electronics; ComponentLink11URL: https://datasheet.octopart.com:443/RC0603FR-0710KL-Yageo-datasheet-164759695.pdf?src-supplier=Future+Electronics; ComponentLink11Description: https://datasheet.octopart.com:443/RC0603FR-0710KL-Yageo-datasheet-164759695.pdf?src-supplier=Future+Electronics; ComponentLink12URL: https://datasheet.octopart.com:443/RC0603FR-0710KL-Yageo-datasheet-127823281.pdf?src-supplier=Future+Electronics; ComponentLink12Description: https://datasheet.octopart.com:443/RC0603FR-0710KL-Yageo-datasheet-127823281.pdf?src-supplier=Future+Electronics; ComponentLink13URL: https://datasheet.octopart.com:443/RC0603FR-0710KL-Yageo-datasheet-137700087.pdf?src-supplier=Future+Electronics; ComponentLink13Description: https://datasheet.octopart.com:443/RC0603FR-0710KL-Yageo-datasheet-137700087.pdf?src-supplier=Future+Electronics; ComponentLink14URL: https://datasheet.octopart.com:443/RC0603FR-0710KL-Yageo-datasheet-27584510.pdf?src-supplier=Future+Electronics; ComponentLink14Description: https://datasheet.octopart.com:443/RC0603FR-0710KL-Yageo-datasheet-27584510.pdf?src-supplier=Future+Electronics; ComponentLink15URL: https://datasheet.octopart.com:443/RC0603FR-0710KL-Yageo-datasheet-8324193.pdf?src-supplier=Future+Electronics; ComponentLink15Description: https://datasheet.octopart.com:443/RC0603FR-0710KL-Yageo-datasheet-8324193.pdf?src-supplier=Future+Electronics; ComponentLink16URL: https://datasheet.octopart.com:443/RC0603FR-0710KL-Yageo-datasheet-12596169.pdf?src-supplier=Newark; ComponentLink16Description: https://datasheet.octopart.com:443/RC0603FR-0710KL-Yageo-datasheet-12596169.pdf?src-supplier=Newark; ComponentLink17URL: https://datasheet.octopart.com:443/RC0603FR-0710KL-Yageo-datasheet-503470.pdf?src-supplier=Newark; ComponentLink17Description: https://datasheet.octopart.com:443/RC0603FR-0710KL-Yageo-datasheet-503470.pdf?src-supplier=Newark; ComponentLink18URL: https://datasheet.octopart.com:443/RC0603FR-0710KL-Yageo-datasheet-34211833.pdf?src-supplier=Newark; ComponentLink18Description: https://datasheet.octopart.com:443/RC0603FR-0710KL-Yageo-datasheet-34211833.pdf?src-supplier=Newark; ComponentLink19URL: https://datasheet.octopart.com:443/RC0603FR-0710KL-Yageo-datasheet-79472498.pdf?src-supplier=Megastar; ComponentLink19Description: https://datasheet.octopart.com:443/RC0603FR-0710KL-Yageo-datasheet-79472498.pdf?src-supplier=Megastar; ComponentLink20URL: https://datasheet.octopart.com/RC0603FR-0710KL-Yageo-datasheet-73766026.pdf; ComponentLink20Description: https://datasheet.octopart.com/RC0603FR-0710KL-Yageo-datasheet-73766026.pdf; ComponentLink21URL: https://datasheet.octopart.com:443/RC0603FR-0710KL-Yageo-datasheet-118562.pdf?src-supplier=DigiKey; ComponentLink21Description: https://datasheet.octopart.com:443/RC0603FR-0710KL-Yageo-datasheet-118562.pdf?src-supplier=DigiKey; ComponentLink22URL: http://sigma.octopart.com:80/rohs_statement/Yageo-company-2.pdf?src-supplier=Compliance+Statements; ComponentLink22Description: http://sigma.octopart.com:80/rohs_statement/Yageo-company-2.pdf?src-supplier=Compliance+Statements; ComponentLink23URL: http://sigma.octopart.com:80/conflict_mineral_statement/Yageo-company-3.pdf?src-supplier=Compliance+Statements; ComponentLink23Description: http://sigma.octopart.com:80/conflict_mineral_statement/Yageo-company-3.pdf?src-supplier=Compliance+Statements; Octopart URL: https://octopart.com/part/yageo-group/RC0603FR-0710KL
R3 = generic Resistor: Library: Hexabitz
SD1-SD6 = HEXABIT_UART_PORT_D
SU1-SU6 = HEXABIT_UART_PORT_U
U1 = STM32G0B1CEU6: MCU 32-bit ARM Cortex M0+ RISC 512KB Flash 1.8V/2.5V/3.3V 48-Pin UFQFPN EP Tray; Manufacturer: STMicroelectronics; Library: Hexabitz; Supplier: Digikey; Supplier Part Number: 497-STM32G0B1CEU6-ND; Manufacturer Part Number: STM32G0B1CEU6; RoHS: Yes; Category: Microcontrollers; Stock: 4305; Pricing: 1=4.78, 10=3.635, 25=3.3488, 100=3.0347, 260=2.87923, 520=2.7899, 1040=2.71638, 2600=2.63877 (USD); Supplier 1: Digikey; Supplier Part Number 1: 497-STM32G0B1CEU6-ND; Octopart URL: https://octopart.com/part/stmicroelectronics/STM32G0B1CEU6
VDD1-VDD6 = HEXABIT_POWER_PORT_U
X1 = CSTCE8M00G52Z-R0: Ceramic Resonator 8MHz ±0.5% (Tol) ±0.2% (Stability) 10pF 40Ohm 3-Pin CSMD T/R; Manufacturer: Murata; Library: Hexabitz; Impedance: 40R; Value: 10pF; Case Code (Imperial): 1206; Case Code (Metric): 3216; Case/Package: 1206; Category: Capacitors; Contact Plating: Gold; Frequency: 8MHz; Frequency Stability: 0.2%; Frequency Tolerance: 0.5%; Height: 0.031inch; Length: 3.2mm; Load Capacitance: 10pF; Manufacturer Part Number: CSTCE8M00G52Z-R0; Max Operating Temperature: 125°C; Min Operating Temperature: -40°C; Mounting Technology: Surface Mount; Pins: 3; Package Quantity: 1; Packaging: Tape and Reel; RoHS Compliant: Yes; Self Resonant Frequency: 8MHz; Series: CERALOCK®; Termination: SMD/SMT; Tolerance: 0.5%; Width: 1.3mm; Octopart URL: https://octopart.com/part/murata/CSTCE8M00G52-R0